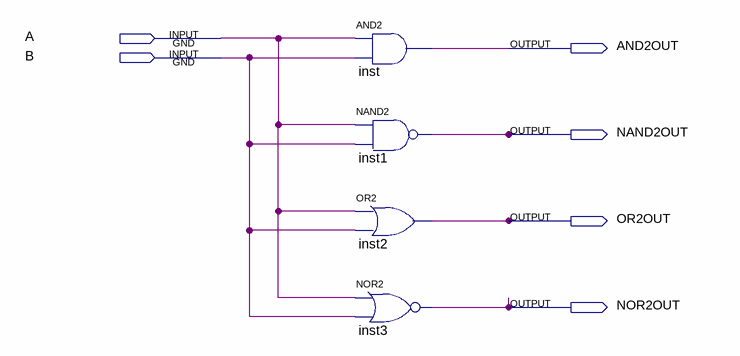
[diagram p0: schematic sheet]
// Quartus schematic lab1_schematic.bdf as structural Verilog: 4 symbols, 6 pins
module lab1_schematic (
  input  A,
  input  B,
  output AND2OUT,
  output NAND2OUT,
  output OR2OUT,
  output NOR2OUT
);

  and inst (AND2OUT, A, B);
  nand inst1 (NAND2OUT, A, B);
  or inst2 (OR2OUT, A, B);
  nor inst3 (NOR2OUT, A, B);
endmodule
